# Altium schematic sheet OSSI-1 Beacon_3.SchDoc: TITLE:
size 410 x 286 mm; Date: Date:; >LAST_DATE_TIME: 01/11/2015 13:17:40; Sheet:: Sheet:; >SHEET: 4; REV:: REV:; Document Number:: Document Number:; >DRAWING_NAME: OSSI-1 Beacon.sch
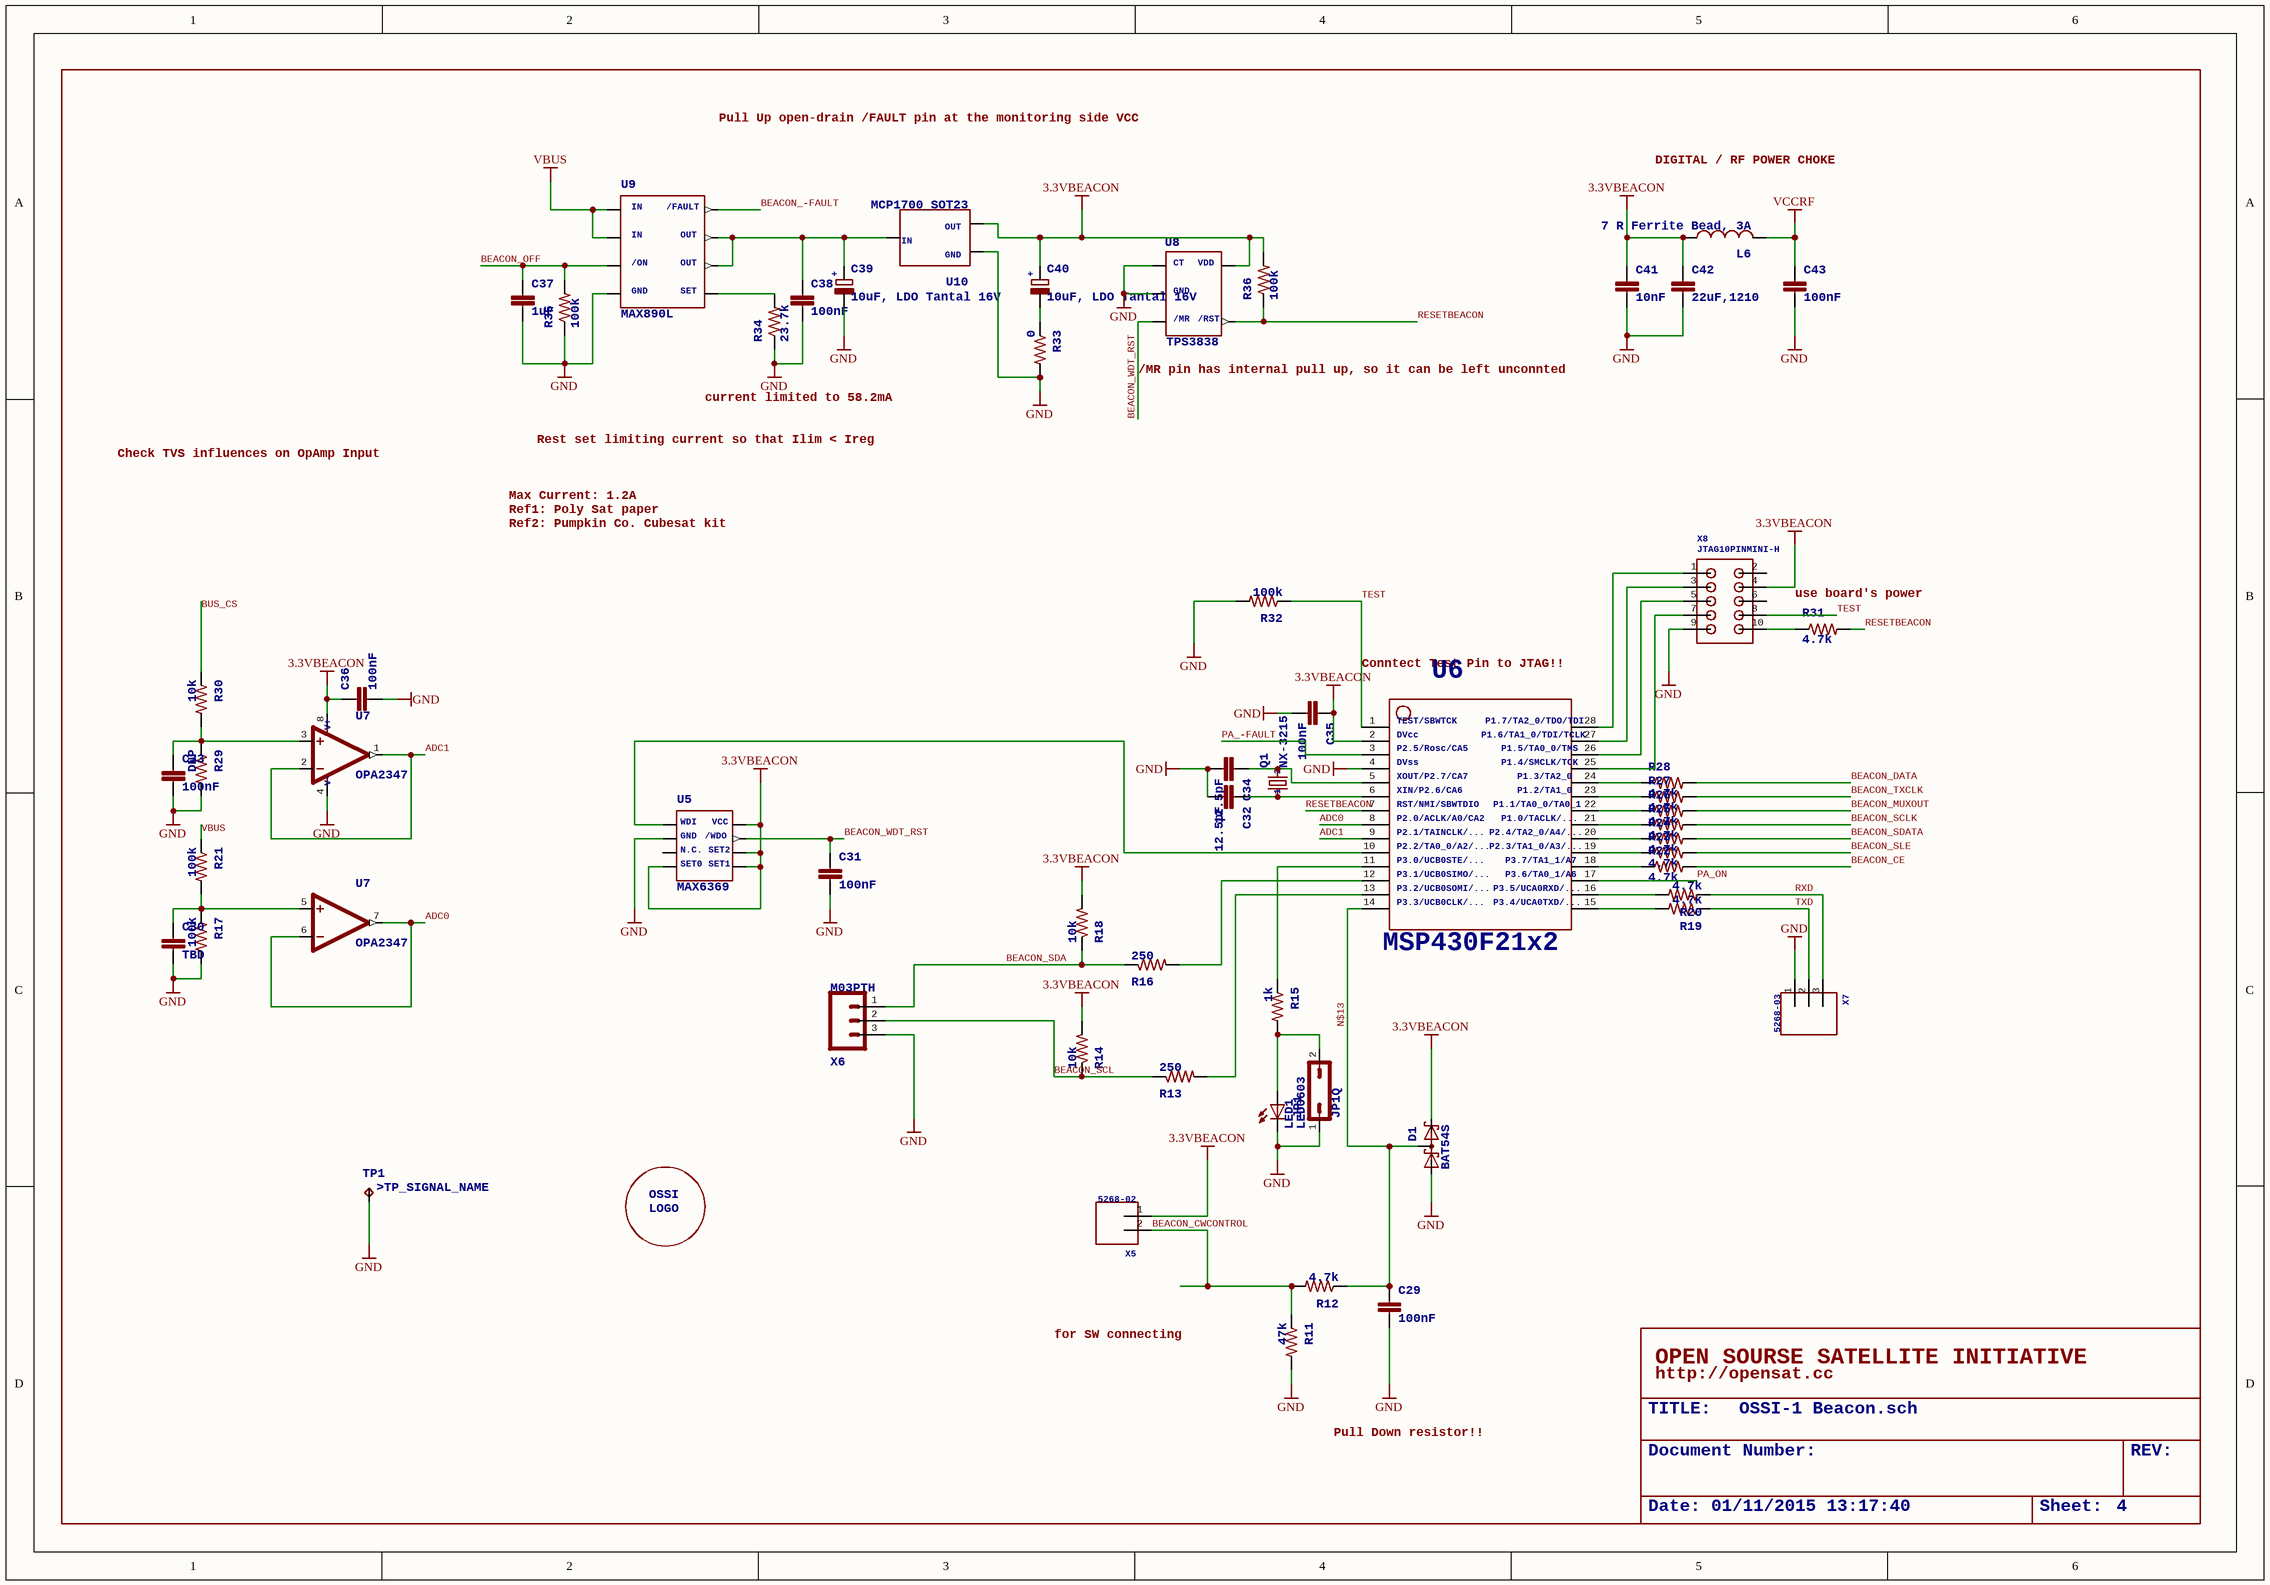
[diagram p0: OSSI-1 Beacon_3.SchDoc]

## Parts
C29  >NAME: C29  [C0603(1608)]  (hidden comment: 100nF)
C30  >NAME: C30  [C0603(1608)]  (hidden comment: TBD)
C31  >NAME: C31  [C0603(1608)]  (hidden comment: 100nF)
C32  >NAME: C32  [C0603(1608)]  (hidden comment: 12.5pF)
C33  >NAME: C33  [C0603(1608)]  (hidden comment: 100nF)
C34  >NAME: C34  [C0603(1608)]  (hidden comment: 12.5pF)
C35  >NAME: C35  [C0603(1608)]  (hidden comment: 100nF)
C36  >NAME: C36  [C0603(1608)]  (hidden comment: 100nF)
C37  >NAME: C37  [C0603(1608)]  (hidden comment: 1uF)
C38  >NAME: C38  [C0603(1608)]  (hidden comment: 100nF)
C39  >NAME: C39  [C1206(3216)-A]  (hidden comment: 10uF, LDO Tantal 16V)
C40  >NAME: C40  [C1206(3216)-A]  (hidden comment: 10uF, LDO Tantal 16V)
C41  >NAME: C41  [C0603(1608)]  (hidden comment: 10nF)
C42  >NAME: C42  [C1210-GCM32]  (hidden comment: 22uF,1210)
C43  >NAME: C43  [C0603(1608)]  (hidden comment: 100nF)
D1  >NAME: D1  [SOT23]  (hidden comment: BAT54S)
JP1  JP1Q  [JP1]
L6  >NAME: L6  [L0805(2012)]  (hidden comment: 7 R Ferrite Bead, 3A)
LED1  >NAME: LED1  [LED-0603]  (hidden comment: LED0603)
Q1  >NAME: Q1  [NX-3215]  (hidden comment: NX-3215)
R11  >NAME: R11  [R0603(1608)]  (hidden comment: 47k)
R12  >NAME: R12  [R0603(1608)]  (hidden comment: 4.7k)
R13  >NAME: R13  [R0603(1608)]  (hidden comment: 250)
R14  >NAME: R14  [R0603(1608)]  (hidden comment: 10k)
R15  >NAME: R15  [R0603(1608)]  (hidden comment: 1k)
R16  >NAME: R16  [R0603(1608)]  (hidden comment: 250)
R17  >NAME: R17  [R0603(1608)]  (hidden comment: 100k)
R18  >NAME: R18  [R0603(1608)]  (hidden comment: 10k)
R19  >NAME: R19  [R0603(1608)]  (hidden comment: 4.7k)
R20  >NAME: R20  [R0603(1608)]  (hidden comment: 4.7k)
R21  >NAME: R21  [R0603(1608)]  (hidden comment: 100k)
R22  >NAME: R22  [R0603(1608)]  (hidden comment: 4.7k)
R23  >NAME: R23  [R0603(1608)]  (hidden comment: 4.7k)
R24  >NAME: R24  [R0603(1608)]  (hidden comment: 4.7k)
R25  >NAME: R25  [R0603(1608)]  (hidden comment: 4.7k)
R26  >NAME: R26  [R0603(1608)]  (hidden comment: 4.7k)
R27  >NAME: R27  [R0603(1608)]  (hidden comment: 4.7k)
R28  >NAME: R28  [R0603(1608)]  (hidden comment: 4.7k)
R29  >NAME: R29  [R0603(1608)]  (hidden comment: DNP)
R30  >NAME: R30  [R0603(1608)]  (hidden comment: 10k)
R31  >NAME: R31  [R0603(1608)]  (hidden comment: 4.7k)
R32  >NAME: R32  [R0603(1608)]  (hidden comment: 100k)
R33  >NAME: R33  [R0603(1608)]  (hidden comment: 0)
R34  >NAME: R34  [R0603(1608)]  (hidden comment: 23.7k)
R35  >NAME: R35  [R0603(1608)]  (hidden comment: 100k)
R36  >NAME: R36  [R0603(1608)]  (hidden comment: 100k)
TP1  >NAME: TP1  [TP-13]  (hidden comment: TP)
U5  >NAME: U5  [SOT23-8]  (hidden comment: MAX6369)
U6  >NAME: U6  [PW28]  (hidden comment: MSP430F2132)
U7  >NAME: U7  [SOT23-8DCN]  (hidden comment: OPA2347)  (parts A,B of 2)
U8  >NAME: U8  [SOT23-5DBV]  (hidden comment: TPS3838)
U9  >NAME: U9  [SO8]  (hidden comment: MAX890L)
U10  >NAME: U10  [SOT23]  (hidden comment: MCP1700_SOT23)
U$1  OSSILOGORECT  [OSSILOGORECT1005]  (value not drawn)
X5  >NAME: X5  [5628-02]  (hidden comment: 5268-02)
X6  >NAME: X6  [1X03]  (hidden comment: M03PTH)
X7  >NAME: X7  [5268-03]  (hidden comment: 5268-03)
X8  >NAME: X8  [M50-3200545]  (hidden comment: JTAG10PINMINI-H)

## Nets
3.3VBEACON: C35.1 C36.1 C40.1(+) C41.1 C42.P$1 D1.2(C2) L6.1 R14.2 R18.2 R36.2 U5.4(P$4) U5.5(P$5) U5.6(P$6) U5.8(P$8) U6.2 U7.8(V+) U8.5(P$5) U10.2 X5.1 X8.4
GND: C29.2 C30.2 C31.2 C32.2 C33.2 C34.2 C35.2 C36.2 C37.2 C38.2 C39.2(-) C41.2 C42.P$2 C43.2 D1.1(A1) JP1.1 LED1.C R11.2 R17.2 R29.2 R32.2 R33.2 R34.1 R35.1 TP1.TP U5.2(P$2) U6.4 U7.4(V-) U8.1(P$1) U8.2(P$2) U9.4(P$4) U10.1 X6.3 X7.1 X8.9
VBUS: R21.1 U9.1(P$1) U9.2(P$2)
VCCRF: C43.1 L6.2
ADC0: U6.8 U7.6(-IN) U7.7(OUT)
ADC1: U6.9 U7.1(OUT) U7.2(-IN)
BEACON_-FAULT: U9.8(P$8)
BEACON_CE: R22.2
BEACON_CWCONTROL: R11.1 R12.2 X5.2
BEACON_DATA: R28.2
BEACON_MUXOUT: R26.2
BEACON_OFF: C37.1 R35.2 U9.3(P$3)
BEACON_SCL: R13.1 R14.1 X6.2
BEACON_SCLK: R25.2
BEACON_SDA: R16.1 R18.1 X6.1
BEACON_SDATA: R24.2
BEACON_SLE: R23.2
BEACON_TXCLK: R27.2
BEACON_WDT_RST: C31.1 U5.7(P$7) U8.3(P$3)
BUS_CS: R30.1
N$13: C29.1 D1.3(C1A2) R12.1 U6.14
PA_-FAULT: U6.3
PA_ON: U6.17
RESETBEACON: R31.2 R36.1 U6.7 U8.4(P$4)
RXD: R20.1 X7.3
TEST: R32.1 U6.1 X8.8
TXD: R19.1 X7.2
NetC30_1: C30.1 R17.1 R21.2 U7.5(+IN)
NetC32_1: C32.1 Q1.1 U6.6
NetC33_1: C33.1 R29.1 R30.2 U7.3(+IN)
NetC34_1: C34.1 Q1.2 U6.5
NetC38_1: C38.1 C39.1(+) U9.6(P$6) U9.7(P$7) U10.3
NetC40_2: C40.2(-) R33.1
NetJP1_2: JP1.2 LED1.A R15.2
NetR13_2: R13.2 U6.13
NetR15_1: R15.1 U6.11
NetR16_2: R16.2 U6.12
NetR19_2: R19.2 U6.15
NetR20_2: R20.2 U6.16
NetR22_1: R22.1 U6.18
NetR23_1: R23.1 U6.19
NetR24_1: R24.1 U6.20
NetR25_1: R25.1 U6.21
NetR26_1: R26.1 U6.22
NetR27_1: R27.1 U6.23
NetR28_1: R28.1 U6.24
NetR31_1: R31.1 X8.10
NetR34_2: R34.2 U9.5(P$5)
NetU5_1: U5.1(P$1) U6.10
NetU6_25: U6.25 X8.7
NetU6_26: U6.26 X8.5
NetU6_27: U6.27 X8.3
NetU6_28: U6.28 X8.1

Not connected (* = marked no-connect by the designer): U5 3(P$3); X8 2 6

## Notes on the sheet
- Pull Up open-drain /FAULT pin at the monitoring side VCC
- DIGITAL / RF POWER CHOKE
- current limited to 58.2mA
- (near U8) /MR pin has internal pull up, so it can be left unconnted
- Check TVS influences on OpAmp Input
- Rest set limiting current so that Ilim < Ireg
- Max Current: 1.2A
- Ref1: Poly Sat paper
- Ref2: Pumpkin Co. Cubesat kit
- (near R31) use board's power
- Conntect Test Pin to JTAG!!
- for SW connecting
- OPEN SOURSE SATELLITE INITIATIVE
- http://opensat.cc
- Pull Down resistor!!

## Library data of the parts
C29-C38 C41 C43 = C0603(1608)
  C29 C31 C33 C35 C36 C38 C43: >VALUE: 100nF
  C30: >VALUE: TBD
  C32 C34: >VALUE: 12.5pF
  C37: >VALUE: 1uF
  C41: >VALUE: 10nF
C39 C40 = C-TANTAL-A: <b>TAJA105M020RNJ</b> / <ul> / <li>Tantal Capacitor / </li> / <li>Manufacturer: AVX / </li> / <li>1206(3126) / </li> / <li>Ref: www.avx.com/docs/techinfo/tantappl.pdf</li> / </ul>; +: +; >VALUE: 10uF, LDO Tantal 16V
C42 = C1210(3225)-GCM32: >VALUE: 22uF,1210
D1 = BAT54S: <b>Schottky Diodes</b><p> / Pin connection corrected 2011-05-04<br> / Source: Fairchild .. BAT54.pdf; >VALUE: BAT54S
JP1 = JP1Q: <b>JUMPER</b>; >NAME: JP1; >VALUE: JP1Q
L6 = L0805(2012): >VALUE: 7 R Ferrite Bead, 3A
LED1 = LED0603: <b>LEDs</b> / Standard schematic elements and footprints for 5mm, 3mm, 1206, and 0603 sized LEDs. 5mm - Spark Fun Electronics SKU : COM-00529 (and others); >VALUE: LED0603
Q1 = NX-3215: NDK 32.768 kHz SMD Crystal<br /> / P/N: NX3215SA-32.768K-STD-MUA-9<br /> / <br /> / <b>Nominal frequency (kHz):</b> 32.768 <br/> / <b>Package Size (L×W×H : mm):</b>  3.2×1.5×0.8 <br/> / <b>Operating Temperature Range(*1)  /  Storage Temperature Range   (°C):</b>  -40 to +85  /  -40 to +85<br/> / <b>Level of drive:</b>   0.1µW (Max. 0.5µW) <br/> / <b>Frequency Tolerance (25±3°C):</b>  ±20×10-6 <br/> / <b>Load Capacitance:</b>  9.0pF, 12.5pF <br/> / <b>Equivalent Series Resistance:</b>  70kΩ Max.<br/> / <b>Ordering Code:</b>  NX3215SA-32.768K-STD-MUA-9 (Load Capacitance9.0pF) /NX3215SA-32.768K-STD-MUA-8 (Load Capacitance12.5pF); >VALUE: NX-3215; 1: 1; 2: 2
R11-R36 = R0603(1608)
  R11: >VALUE: 47k
  R12 R19 R20 R22-R28 R31: >VALUE: 4.7k
  R13 R16: >VALUE: 250
  R14 R18 R30: >VALUE: 10k
  R15: >VALUE: 1k
  R17 R21 R32 R35 R36: >VALUE: 100k
  R29: >VALUE: DNP
  R33: >VALUE: 0
  R34: >VALUE: 23.7k
U5 = MAX6369: <B>MAX6369</B> / <ul> / <li>Pin-Selectable Watchdog Timers</li> / <li>Max 6369 is Open-drain output</li> / <li>1 ms to 60 s seletable timeout</li> / </ul>; WDI: WDI; GND: GND; N.C.: N.C.; SET0: SET0; SET1: SET1; SET2: SET2; /WDO: /WDO; VCC: VCC; >VALUE: MAX6369
U6 = MSP430F2132: *** MSP430F21x2 *** PW28; TEST/SBWTCK: TEST/SBWTCK; DVcc: DVcc; P2.5/Rosc/CA5: P2.5/Rosc/CA5; DVss: DVss; XOUT/P2.7/CA7: XOUT/P2.7/CA7; XIN/P2.6/CA6: XIN/P2.6/CA6; RST/NMI/SBWTDIO: RST/NMI/SBWTDIO; P2.0/ACLK/A0/CA2: P2.0/ACLK/A0/CA2; P2.1/TAINCLK/...: P2.1/TAINCLK/...; P2.2/TA0_0/A2/...: P2.2/TA0_0/A2/...; P1.7/TA2_0/TDO/TDI: P1.7/TA2_0/TDO/TDI; P1.6/TA1_0/TDI/TCLK: P1.6/TA1_0/TDI/TCLK; P1.5/TA0_0/TMS: P1.5/TA0_0/TMS; P1.4/SMCLK/TCK: P1.4/SMCLK/TCK; P1.3/TA2_0: P1.3/TA2_0; P1.2/TA1_0: P1.2/TA1_0; P1.1/TA0_0/TA0_1: P1.1/TA0_0/TA0_1; P1.0/TACLK/...: P1.0/TACLK/...; P2.4/TA2_0/A4/...: P2.4/TA2_0/A4/...; P2.3/TA1_0/A3/...: P2.3/TA1_0/A3/...; MSP430F21x2: MSP430F21x2; P3.7/TA1_1/A7: P3.7/TA1_1/A7; P3.6/TA0_1/A6: P3.6/TA0_1/A6; P3.5/UCA0RXD/...: P3.5/UCA0RXD/...; P3.4/UCA0TXD/...: P3.4/UCA0TXD/...; P3.3/UCB0CLK/...: P3.3/UCB0CLK/...; P3.2/UCB0SOMI/...: P3.2/UCB0SOMI/...; P3.1/UCB0SIMO/...: P3.1/UCB0SIMO/...; P3.0/UCB0STE/...: P3.0/UCB0STE/...
U7 = OPA2347: <b>OPA2347</b> / <ul> / <li>RAIL-TO-RAIL INPUT AND OUTPUT</li> / <li>SINGLE SUPPLY: 2.3V to 5.5V</li> / <li>LOW IQ: 20µ</li> / </ul>; >VALUE: OPA2347; V+: V+; V-: V-
U8 = TPS3838: <b>TPS3838</b> / <br /> / NanoPower Supervisory IC from texas instruments.<br /> / TPS3838 is open-drain output; >VALUE: TPS3838; CT: CT; /MR: /MR; GND: GND; VDD: VDD; /RST: /RST
U9 = MAX890L: <B>MAX 890L</B> / <BR /> / 1.2A, Current-Limited, High-Side / P-Channel Switch with Thermal Shutdown BY MAXIM; IN: IN; /ON: /ON; GND: GND; SET: SET; OUT: OUT; /FAULT: /FAULT; >VALUE: MAX890L
U10 = MCP1700_SOT23: MCP1700 LDO from Microchips; >VALUE: MCP1700_SOT23; IN: IN; GND: GND; OUT: OUT
X6 = M03PTH: <b>Header 3</b> / Standard 3-pin 0.1" header. Use with straight break away headers (SKU : PRT-00116), right angle break away headers (PRT-00553), swiss pins (PRT-00743), machine pins (PRT-00117), and female headers (PRT-00115). Molex polarized connector foot print use with SKU : PRT-08232 with associated crimp pins and housings.; >VALUE: M03PTH
TP1 = TP: >TP_SIGNAL_NAME: >TP_SIGNAL_NAME
U$1 = OSSILOGORECT: OSSI: OSSI; LOGO: LOGO
X5 = 5268-02: >VALUE: 5268-02
X7 = 5268-03: >VALUE: 5268-03
X8 = JTAG10PINMINI-H: >VALUE: JTAG10PINMINI-H